# Altium schematic sheet FPGA-5.SchDoc
size A3; Date: Date; CompanyName: HESSO; Engineer: Name; Address1: Route du Rawyl 47; Address2: 1950 Sion; Address3: Switzerland; ProjectName: Project Name
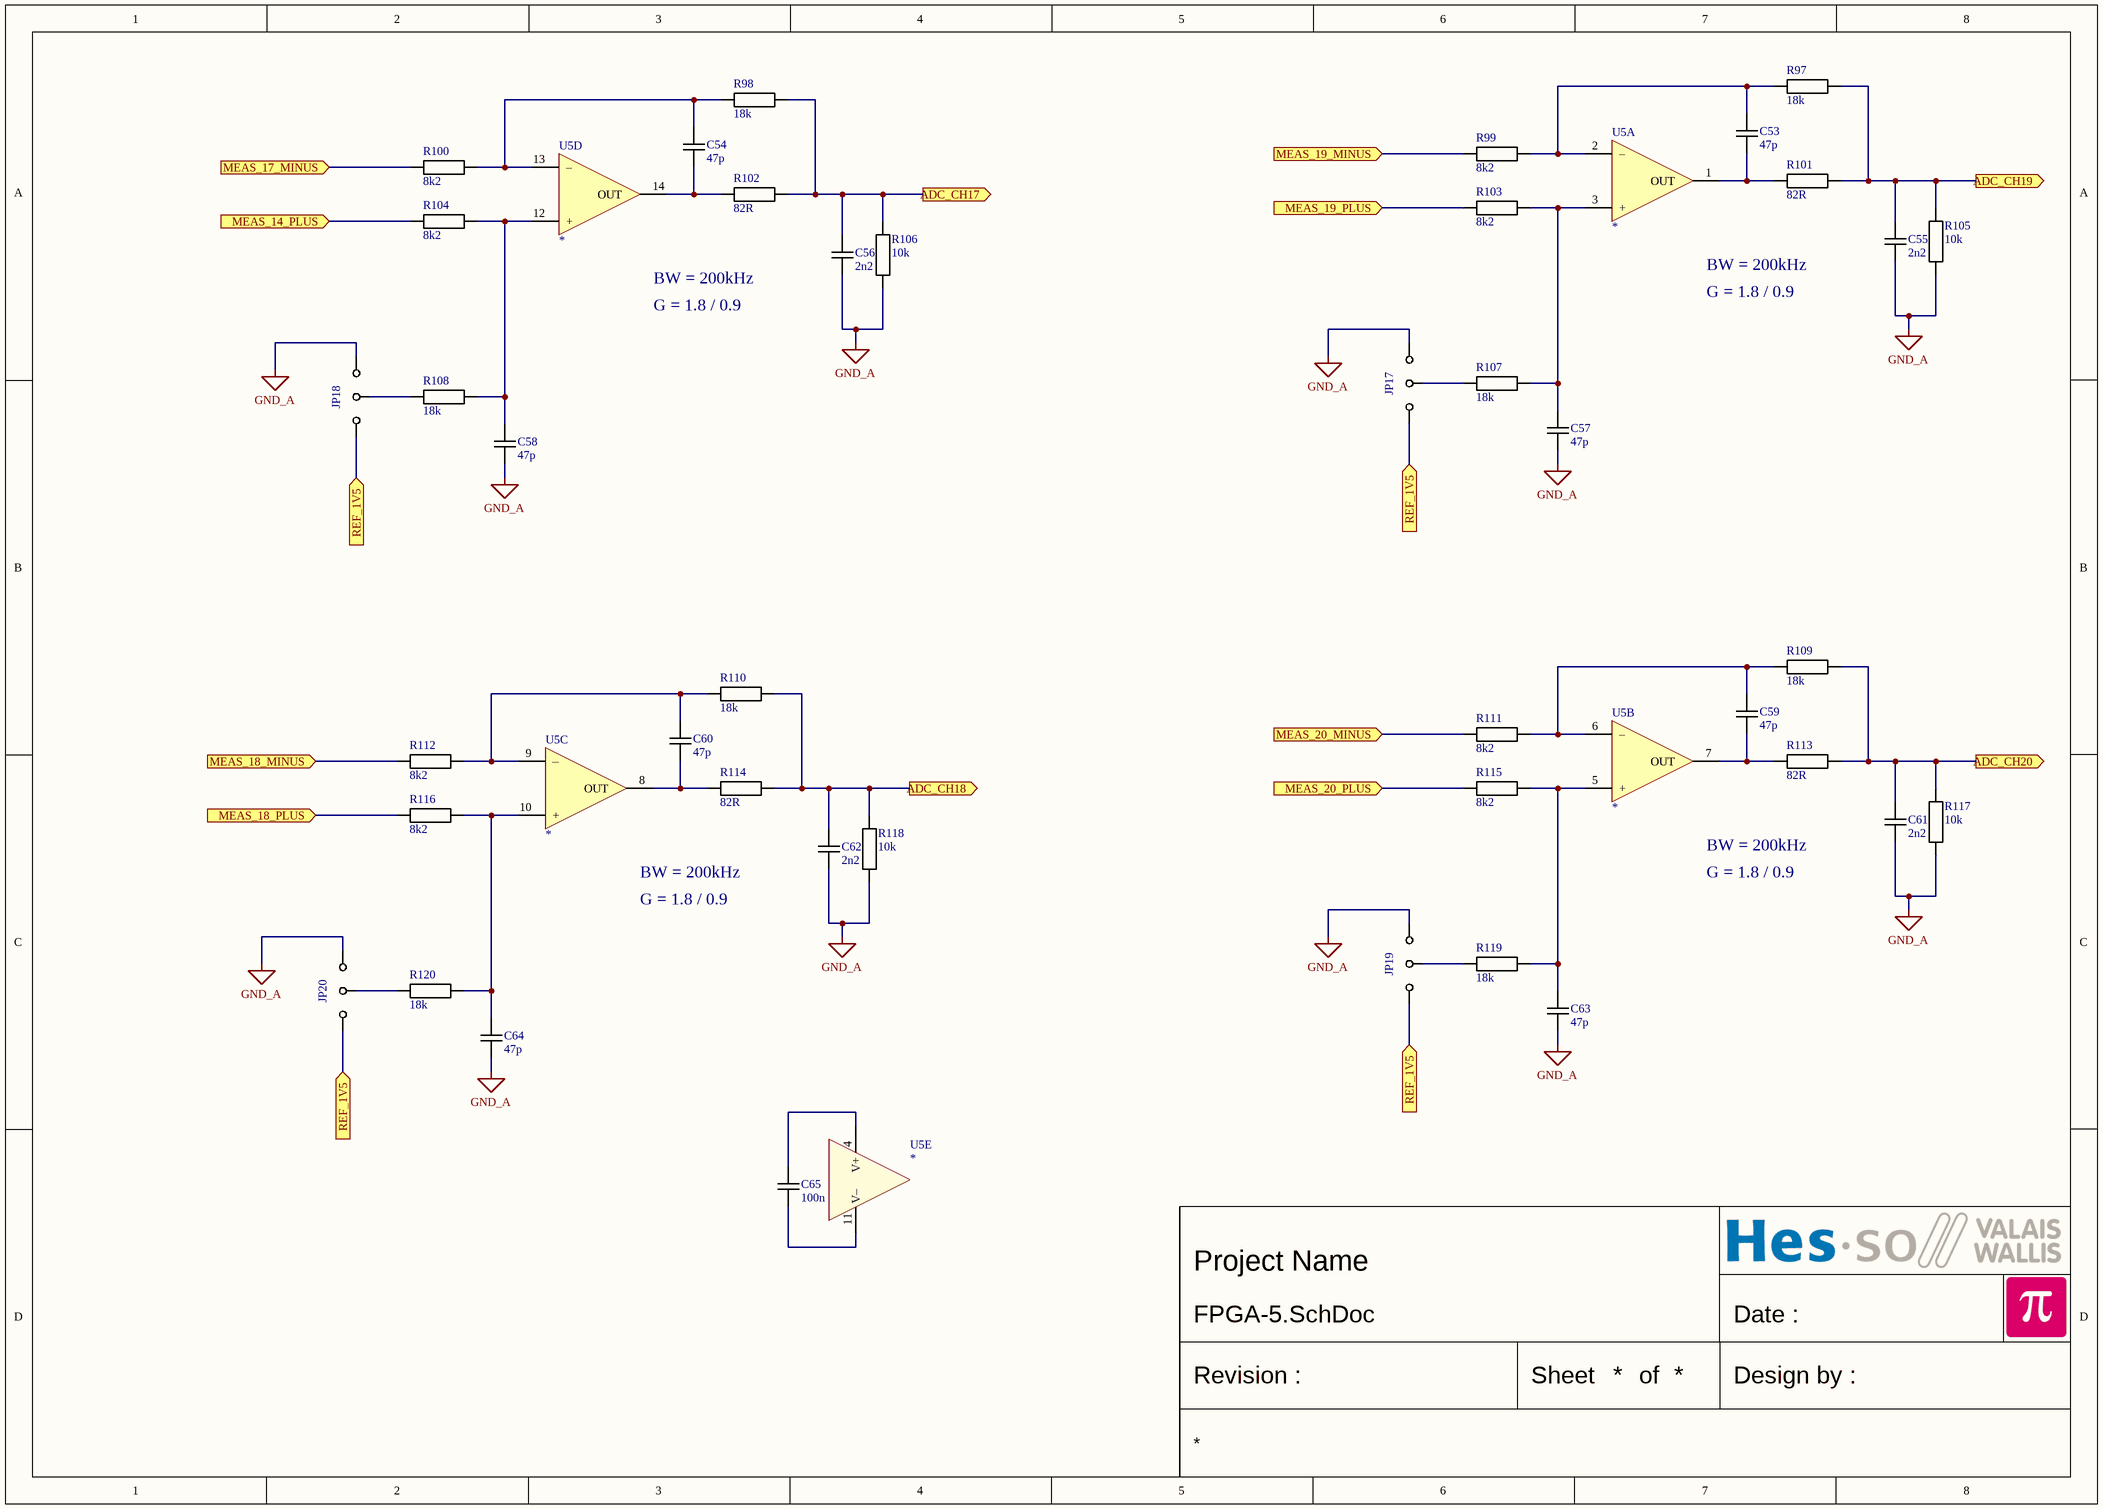
[diagram p0: FPGA-5.SchDoc]

## Parts
C53  47p  [CAPACITOR 1608 REFLOW]
C54  47p  [CAPACITOR 1608 REFLOW]
C55  2n2  [CAPACITOR 1608 REFLOW]
C56  2n2  [CAPACITOR 1608 REFLOW]
C57  47p  [CAPACITOR 1608 REFLOW]
C58  47p  [CAPACITOR 1608 REFLOW]
C59  47p  [CAPACITOR 1608 REFLOW]
C60  47p  [CAPACITOR 1608 REFLOW]
C61  2n2  [CAPACITOR 1608 REFLOW]
C62  2n2  [CAPACITOR 1608 REFLOW]
C63  47p  [CAPACITOR 1608 REFLOW]
C64  47p  [CAPACITOR 1608 REFLOW]
C65  100n  [CAPACITOR 1608 REFLOW]
JP17  {Value}  [JUMPER3 SMD 1608]  (value not drawn)
JP18  {Value}  [JUMPER3 SMD 1608]  (value not drawn)
JP19  {Value}  [JUMPER3 SMD 1608]  (value not drawn)
JP20  {Value}  [JUMPER3 SMD 1608]  (value not drawn)
R97  18k  [RESISTOR 1608 REFLOW]
R98  18k  [RESISTOR 1608 REFLOW]
R99  8k2  [RESISTOR 1608 REFLOW]
R100  8k2  [RESISTOR 1608 REFLOW]
R101  82R  [RESISTOR 1608 REFLOW]
R102  82R  [RESISTOR 1608 REFLOW]
R103  8k2  [RESISTOR 1608 REFLOW]
R104  8k2  [RESISTOR 1608 REFLOW]
R105  10k  [RESISTOR 1608 REFLOW]
R106  10k  [RESISTOR 1608 REFLOW]
R107  18k  [RESISTOR 1608 REFLOW]
R108  18k  [RESISTOR 1608 REFLOW]
R109  18k  [RESISTOR 1608 REFLOW]
R110  18k  [RESISTOR 1608 REFLOW]
R111  8k2  [RESISTOR 1608 REFLOW]
R112  8k2  [RESISTOR 1608 REFLOW]
R113  82R  [RESISTOR 1608 REFLOW]
R114  82R  [RESISTOR 1608 REFLOW]
R115  8k2  [RESISTOR 1608 REFLOW]
R116  8k2  [RESISTOR 1608 REFLOW]
R117  10k  [RESISTOR 1608 REFLOW]
R118  10k  [RESISTOR 1608 REFLOW]
R119  18k  [RESISTOR 1608 REFLOW]
R120  18k  [RESISTOR 1608 REFLOW]
U5  *  [SO14 P1.27 C4.0X8.8 H1.75]  (parts A,B,C,D,E of 5)

## Ports
ADC_CH17 (out), ADC_CH18 (out), ADC_CH19 (out), ADC_CH20 (out), MEAS_14_PLUS (in), MEAS_17_MINUS (in), MEAS_18_MINUS (in), MEAS_18_PLUS (in), MEAS_19_MINUS (in), MEAS_19_PLUS (in), MEAS_20_MINUS (in), MEAS_20_PLUS (in), REF_1V5 (in)

## Nets
GND_A: C55.1 C56.1 C57.1 C58.1 C61.1 C62.1 C63.1 C64.1 JP17.3 JP18.3 JP19.3 JP20.3 R105.2 R106.2 R117.2 R118.2
ADC_CH17: C56.2 R98.2 R102.2 R106.1 ; port ADC_CH17
ADC_CH18: C62.2 R110.2 R114.2 R118.1 ; port ADC_CH18
ADC_CH19: C55.2 R97.2 R101.2 R105.1 ; port ADC_CH19
ADC_CH20: C61.2 R109.2 R113.2 R117.1 ; port ADC_CH20
MEAS_14_PLUS: R104.1 ; port MEAS_14_PLUS
MEAS_17_MINUS: R100.1 ; port MEAS_17_MINUS
MEAS_18_MINUS: R112.1 ; port MEAS_18_MINUS
MEAS_18_PLUS: R116.1 ; port MEAS_18_PLUS
MEAS_19_MINUS: R99.1 ; port MEAS_19_MINUS
MEAS_19_PLUS: R103.1 ; port MEAS_19_PLUS
MEAS_20_MINUS: R111.1 ; port MEAS_20_MINUS
MEAS_20_PLUS: R115.1 ; port MEAS_20_PLUS
REF_1V5: JP17.1 JP18.1 JP19.1 JP20.1 ; port REF_1V5
NetC53_1: C53.1 R101.1 U5.1(OUT)
NetC53_2: C53.2 R97.1 R99.2 U5.2(–)
NetC54_1: C54.1 R102.1 U5.14(OUT)
NetC54_2: C54.2 R98.1 R100.2 U5.13(–)
NetC57_2: C57.2 R103.2 R107.1 U5.3(+)
NetC58_2: C58.2 R104.2 R108.1 U5.12(+)
NetC59_1: C59.1 R113.1 U5.7(OUT)
NetC59_2: C59.2 R109.1 R111.2 U5.6(–)
NetC60_1: C60.1 R114.1 U5.8(OUT)
NetC60_2: C60.2 R110.1 R112.2 U5.9(–)
NetC63_2: C63.2 R115.2 R119.1 U5.5(+)
NetC64_2: C64.2 R116.2 R120.1 U5.10(+)
NetC65_1: C65.1 U5.11(V–)
NetC65_2: C65.2 U5.4(V+)
NetJP17_2: JP17.2 R107.2
NetJP18_2: JP18.2 R108.2
NetJP19_2: JP19.2 R119.2
NetJP20_2: JP20.2 R120.2

## Notes on the sheet
- BW = 200kHz
- G = 1.8 / 0.9
- Date :
- Revision :
- Sheet
- of
- Design by :

## Library data of the parts
C53-C65 = Capacitor: Capacitor X7R 10% 50V 1608(0603)
  C53 C54 C57-C60 C63 C64: Value: 47p
  C55 C56 C61 C62: Value: 2n2
  C65: Value: 100n
JP17-JP20 = JUMPER 3 POS: Value: {Value}
R97-R120 = Resistor: Resistor 1% 50V 100mW 1608(0603)
  R97 R98 R107-R110 R119 R120: Value: 18k
  R99 R100 R103 R104 R111 R112 R115 R116: Value: 8k2
  R101 R102 R113 R114: Value: 82R
  R105 R106 R117 R118: Value: 10k
U5 = OPA QUAD: Generic quad OPA 14 pins; Value: *